# EAGLE design Ctrl_Enc (EAGLE 9.1.2)
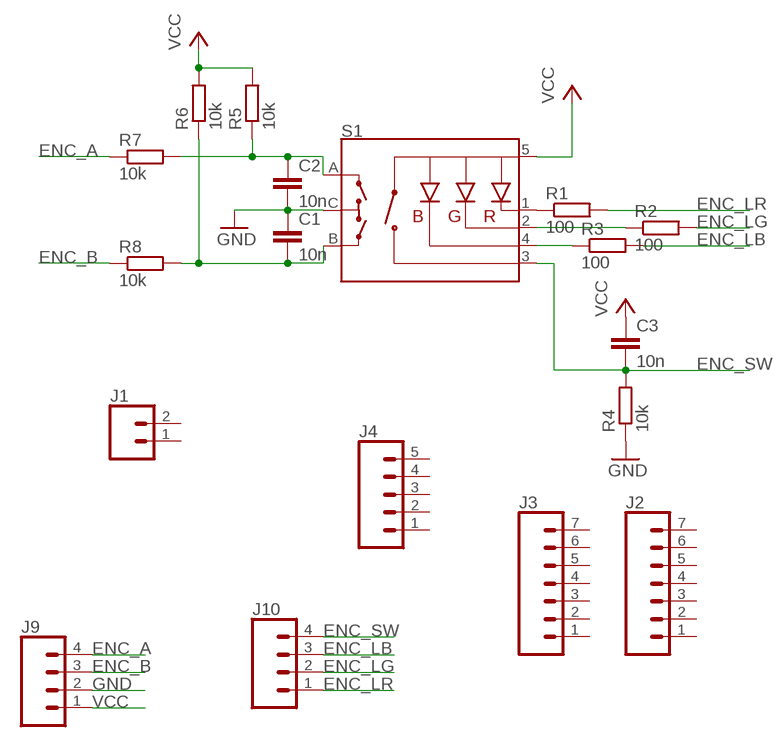
[diagram p0: schematic, sheet 1]

## Parts
C1  10n  C-EUC0603  [C0603]
C2  10n  C-EUC0603  [C0603]
C3  10n  C-EUC0603  [C0603]
J1  CONN_02  [1X02]
J2  CONN_07  [1X07]
J3  CONN_07  [1X07]
J4  CONN_05  [1X05]
J9  CONN_04  [1X04]
J10  CONN_04  [1X04]
R1  100  R-EU_R0603  [R0603]
R2  100  R-EU_R0603  [R0603]
R3  100  R-EU_R0603  [R0603]
R4  10k  R-EU_R0603  [R0603]
R5  10k  R-EU_R0603  [R0603]
R6  10k  R-EU_R0603  [R0603]
R7  10k  R-EU_R0603  [R0603]
R8  10k  R-EU_R0603  [R0603]
S1  ENCODER-RGB-SWITCH  [ENCODER_LED_3]

## Nets
ENC_A: J9.4 R7.1
ENC_B: J9.3 R8.1
ENC_LB: J10.3 R3.2
ENC_LG: J10.2 R2.2
ENC_LR: J10.1 R1.2
ENC_SW: C3.2 J10.4 R4.2 S1.3(SW)
GND: C1.1 C2.2 J9.2 R4.1 S1.C
N$1: R1.1 S1.1(-R)
N$2: R2.1 S1.2(-G)
N$3: R3.1 S1.4(-B)
N$4: C1.2 R6.1 R8.2 S1.B
N$5: C2.1 R5.1 R7.2 S1.A
VCC: C3.1 J9.1 R5.2 R6.2 S1.5(+)
Unconnected: J1.1 J1.2 J2.1 J2.2 J2.3 J2.4 J2.5 J2.6 J2.7 J3.1 J3.2 J3.3 J3.4 J3.5 J3.6 J3.7 J4.1 J4.2 J4.3 J4.4 J4.5

## Library data of the parts
C1-C3 = rcl:C-EU: CAPACITOR, European symbol; SPICEPREFIX: C
J1 = SparkFun-Connectors:CONN_02: Multi connection point. Often used as Generic Header-pin footprint for 0.1 inch spaced/style header connections On any of the 0.1 inch spaced packages, you can populate with these: Break Away Headers - Straight <https://www.sparkfun.com/products/116> (PRT-00116) Break Away Male Headers - Right Angle <https://www.sparkfun.com/products/553> (PRT-00553) Female Headers <https://www.sparkfun.com/products/115> (PRT-00115) Break Away Headers - Machine Pin <https://www.sparkfun.com/products/117> (PRT-00117) Break Away Female Headers - Swiss Machine Pin <https://www.sparkfun.com/products/743> (PRT-00743) For SCREWTERMINALS and SPRING TERMINALS visit here: Screw Terimnals on SparkFun.com <https://www.sparkfun.com/search/results?term=Screw+Terminals> (5mm/3.5mm/2.54mm spacing) This device is also useful as a general connection point to wire up your design to another part of your project. Our various solder wires solder well into these plated through hole pads. Hook-Up Wire - Assortment (Stranded, 22 AWG) <https://www.sparkfun.com/products/11375> (PRT-11375) Hook-Up Wire - Assortment (Solid Core, 22 AWG) <https://www.sparkfun.com/products/11367> (PRT-11367) View the entire wire category on our website here <https://www.sparkfun.com/categories/141> Special notes: Molex polarized connector foot print use with: PRT-08233 with associated crimp pins and housings. 2.54_SCREWTERM for use with PRT-10571. 3.5mm Screw Terminal footprints for PRT-08084 5mm Screw Terminal footprints for use with PRT-08432
J2 J3 = SparkFun-Connectors:CONN_07: Multi connection point. Often used as Generic Header-pin footprint for 0.1 inch spaced/style header connections On any of the 0.1 inch spaced packages, you can populate with these: Break Away Headers - Straight <https://www.sparkfun.com/products/116> (PRT-00116) Break Away Male Headers - Right Angle <https://www.sparkfun.com/products/553> (PRT-00553) Female Headers <https://www.sparkfun.com/products/115> (PRT-00115) Break Away Headers - Machine Pin <https://www.sparkfun.com/products/117> (PRT-00117) Break Away Female Headers - Swiss Machine Pin <https://www.sparkfun.com/products/743> (PRT-00743) For SCREWTERMINALS and SPRING TERMINALS visit here: Screw Terimnals on SparkFun.com <https://www.sparkfun.com/search/results?term=Screw+Terminals> (5mm/3.5mm/2.54mm spacing) This device is also useful as a general connection point to wire up your design to another part of your project. Our various solder wires solder well into these plated through hole pads. Hook-Up Wire - Assortment (Stranded, 22 AWG) <https://www.sparkfun.com/products/11375> (PRT-11375) Hook-Up Wire - Assortment (Solid Core, 22 AWG) <https://www.sparkfun.com/products/11367> (PRT-11367) View the entire wire category on our website here <https://www.sparkfun.com/categories/141> Special notes: Molex polarized connector foot print use with SKU : PRT-08231 with associated crimp pins and housings. 1MM SMD Version SKU: PRT-10208 NOTES ON THE VARIANTS LOCK and LOCK_LONGPADS... This footprint was designed to help hold the alignment of a through-hole component (i.e. 6-pin header) while soldering it into place. You may notice that each hole has been shifted either up or down by 0.005 of an inch from it's more standard position (which is a perfectly straight line). This slight alteration caused the pins (the squares in the middle) to touch the edges of the holes. Because they are alternating, it causes a "brace" to hold the component in place. 0.005 has proven to be the perfect amount of "off-center" position when using our standard breakaway headers. Although looks a little odd when you look at the bare footprint, once you have a header in there, the alteration is very hard to notice. Also,if you push a header all the way into place, it is covered up entirely on the bottom side.
J4 = SparkFun-Connectors:CONN_05: Multi connection point. Often used as Generic Header-pin footprint for 0.1 inch spaced/style header connections On any of the 0.1 inch spaced packages, you can populate with these: Break Away Headers - Straight <https://www.sparkfun.com/products/116> (PRT-00116) Break Away Male Headers - Right Angle <https://www.sparkfun.com/products/553> (PRT-00553) Female Headers <https://www.sparkfun.com/products/115> (PRT-00115) Break Away Headers - Machine Pin <https://www.sparkfun.com/products/117> (PRT-00117) Break Away Female Headers - Swiss Machine Pin <https://www.sparkfun.com/products/743> (PRT-00743) For SCREWTERMINALS and SPRING TERMINALS visit here: Screw Terimnals on SparkFun.com <https://www.sparkfun.com/search/results?term=Screw+Terminals> (5mm/3.5mm/2.54mm spacing) This device is also useful as a general connection point to wire up your design to another part of your project. Our various solder wires solder well into these plated through hole pads. Hook-Up Wire - Assortment (Stranded, 22 AWG) <https://www.sparkfun.com/products/11375> (PRT-11375) Hook-Up Wire - Assortment (Solid Core, 22 AWG) <https://www.sparkfun.com/products/11367> (PRT-11367) View the entire wire category on our website here <https://www.sparkfun.com/categories/141> Special notes: Molex polarized connector foot print use with SKU : PRT-08231 with associated crimp pins and housings. 1MM SMD Version SKU: PRT-10208
J9 J10 = SparkFun-Connectors:CONN_04: Multi connection point. Often used as Generic Header-pin footprint for 0.1 inch spaced/style header connections On any of the 0.1 inch spaced packages, you can populate with these: Break Away Headers - Straight <https://www.sparkfun.com/products/116> (PRT-00116) Break Away Male Headers - Right Angle <https://www.sparkfun.com/products/553> (PRT-00553) Female Headers <https://www.sparkfun.com/products/115> (PRT-00115) Break Away Headers - Machine Pin <https://www.sparkfun.com/products/117> (PRT-00117) Break Away Female Headers - Swiss Machine Pin <https://www.sparkfun.com/products/743> (PRT-00743) For SCREWTERMINALS and SPRING TERMINALS visit here: Screw Terimnals on SparkFun.com <https://www.sparkfun.com/search/results?term=Screw+Terminals> (5mm/3.5mm/2.54mm spacing) This device is also useful as a general connection point to wire up your design to another part of your project. Our various solder wires solder well into these plated through hole pads. Hook-Up Wire - Assortment (Stranded, 22 AWG) <https://www.sparkfun.com/products/11375> (PRT-11375) Hook-Up Wire - Assortment (Solid Core, 22 AWG) <https://www.sparkfun.com/products/11367> (PRT-11367) View the entire wire category on our website here <https://www.sparkfun.com/categories/141> Special notes: Molex polarized connector foot print use with SKU : PRT-08231 with associated crimp pins and housings. 1MM SMD Version SKU: PRT-10208; PROD_ID: CONN-09696
R1-R8 = rcl:R-EU_: RESISTOR, European symbol; SPICEPREFIX: R
S1 = SparkFun-Switches:ENCODER-RGB-SWITCH: Illuminated Rotary Encoder w/ RGB LED and select switch Encoders rotate similarly to potentiometers, but they’re different from potentiometers in that an encoder has full rotation without limits. They output gray code so that you can tell how much and in which direction the encoder has been turned. This encoder includes an RGB LED and a push-down select switch. Part #: Top Up EC12PLRGBSDVBF-D <http://top-up.so-buy.com/front/bin/ptdetail.phtml?Part=EC12PLRGBSDVBF-D> SparkFun Products Rotary Encoder - Illuminated (RGB) <https://www.sparkfun.com/products/10982> (COM-10982); PROD_ID: RES-10859; SF_SKU: COM-10982

## Board
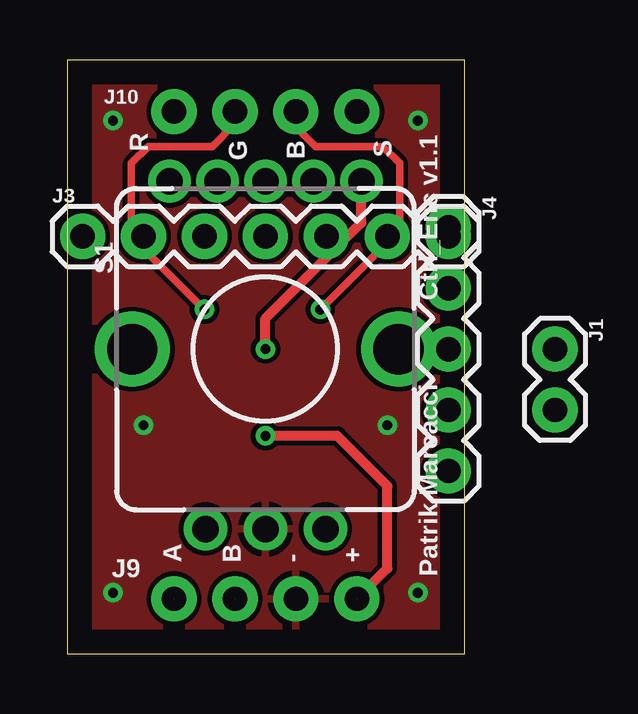
[diagram p1: board, top side]
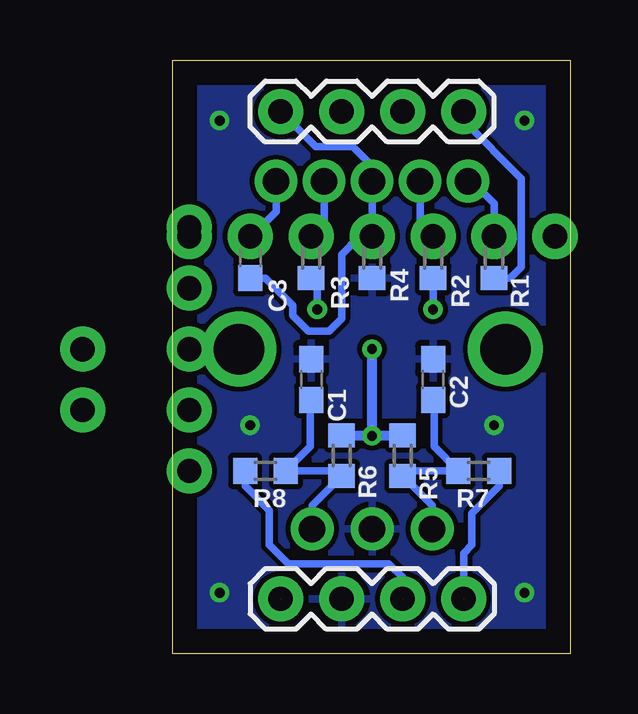
[diagram p2: board, bottom side, seen from below]

Size 16.56 x 24.75 mm. Coordinates in mm from the lower left corner, seen from the top.
Outline: 0,0 16.56,0 16.56,24.75 0,24.75 0,0
Copper layers (1*16): Top 0.035mm / dielectric 1.5mm / Bottom 0.035mm
Design rules "default *": minimum track width 8mil, minimum drill 16mil, track to track 8mil, track to pad 10mil, pad to pad 8mil, via to via 8mil, smd to smd 8mil, copper to edge 40mil, drill to drill 8mil, minimum pad ring 10mil, minimum via ring 8mil, stop-mask expansion 4mil, vias tented up to drill 0mil, thermal gap 10mil

### Footprints (pad centres in the part's own frame; a part is rotated, then mirrored left to right if it is on the bottom)
C0603 = smd 1.1 x 1: 1 -0.85,0; 2 0.85,0
1X02 = drill 1.016 pad 1.88: 1 0,0; 2 2.54,0
1X07 = drill 1.016 pad 1.88: 1 0,0; 2 2.54,0; 3 5.08,0; 4 7.62,0; 5 10.16,0; 6 12.7,0; 7 15.24,0
1X05 = drill 1.016 pad 1.88: 1 0,0; 2 2.54,0; 3 5.08,0; 4 7.62,0; 5 10.16,0
1X04 = drill 1.016 pad 1.88: 1 0,0; 2 2.54,0; 3 5.08,0; 4 7.62,0
R0603 = smd 1 x 1.1: 1 -0.85,0; 2 0.85,0
ENCODER_LED_3 = drill 1.1 pad 1.778: 1 -4,7; 2 -2,7; 3 0,7; 4 2,7; 5 4,7 | drill 1.1 pad 1.8: A -2.5,-7.5; B 2.5,-7.5; C 0,-7.5 | drill 2.1: M1 -5.55,0; M2 5.55,0

### Placement (x,y rotation side)
C1  10.79,11.43 270 bottom
C2  5.71,11.43 90 bottom
C3  13.33,16.51 270 bottom
J1  20.32,12.7 270 top  (outside the outline)
J2  0,-8.26 0 top  (outside the outline)
J3  0.63,17.4 0 top
J4  15.87,17.78 270 top
J9  12.06,2.29 0 bottom
J10  4.44,22.61 180 bottom
R1  3.17,16.51 270 bottom
R2  5.71,16.51 270 bottom
R3  10.79,16.51 270 bottom
R4  8.26,16.51 90 bottom
R5  6.98,8.25 90 bottom
R6  9.53,8.25 90 bottom
R7  3.81,7.62 180 bottom
R8  12.7,7.62 0 bottom
S1  8.26,12.7 0 top

### Tracks (layer width: path | path; a pad name or v marks a point on that pad's centre or on a via)
ENC_A  (1 unrouted)
  Bottom 0.305: J9.4 4.44,4.19 4.1,4.53 4.1,5.84 2.96,6.99 R7.1
ENC_B  (1 unrouted)
  Bottom 0.305: J9.3 6.98,3.17 7.56,3.75 11.75,3.75 12.53,4.53 12.53,5.97 13.55,6.99 R8.1
ENC_LB  (via drill 0.41)
  Top 0.305: v10.54,14.35 13.84,17.65 13.84,20.45 13.14,21.14 10.35,21.14 9.53,21.97 J10.3
  Bottom 0.305: v10.54,14.35 10.54,15.41 R3.2
ENC_LG  (via drill 0.41)
  Top 0.305: v5.71,14.35 2.67,17.4 2.67,20.45 3.36,21.14 6.03,21.14 6.98,22.1 J10.2
  Bottom 0.305: R2.2 v5.71,14.35
ENC_LR
  Bottom 0.305: R1.2 2.5,15.66 2.03,16.13 2.03,19.81 4.44,22.22 J10.1
ENC_SW
  Bottom 0.305: J10.4 10.6,21.14 9.06,21.14 8.26,20.33 S1.3 R4.2 8.8,17.36 9.53,16.64 9.53,13.97 10.03,13.46 10.92,13.46 11.56,14.1 11.56,14.52 12.7,15.66 C3.2
GND  (via drill 0.41)
  other vias: 3.17,9.52 13.33,9.52 1.9,22.22 14.6,22.22 14.6,2.54 1.9,2.54
  pour Top: 0,24.76 0,0 16.51,0 16.51,24.76
  pour Bottom: 0,24.76 16.51,24.76 16.51,0 0,0
N$1
  Bottom 0.305: S1.1 4.12,19.7 3.17,18.76 R1.1
N$2
  Bottom 0.305: S1.2 6.25,17.9 R2.1
N$3
  Bottom 0.305: S1.4 10.26,17.9 R3.1
N$4
  Bottom 0.305: S1.B 10.76,6.17 R6.1 9.74,7.62 R8.2 10.83,8.64 10.83,10.54 C1.2
N$5
  Bottom 0.305: S1.A 5.75,6.17 R5.1 6.77,7.62 R7.2 5.68,8.64 5.68,10.54 C2.1
VCC  (via drill 0.41)  (1 unrouted)
  Top 0.406: J9.1 13.33,3.56 13.33,6.99 11.24,9.08 v8.26,9.08 | S1.5 12.26,17.97 8.26,13.97 v8.26,12.7
  Bottom 0.305: C3.1 12.26,18.44 S1.5
  Bottom 0.406: v8.26,9.08 v8.26,12.7 | R5.2 7.01,9.08 v8.26,9.08 | v8.26,9.08 9.5,9.08 R6.2

### Text on the board
tNames: R | G | B | S | Ctrl_Enc v1.1 | A | B | - | + | Patrik Marcacci